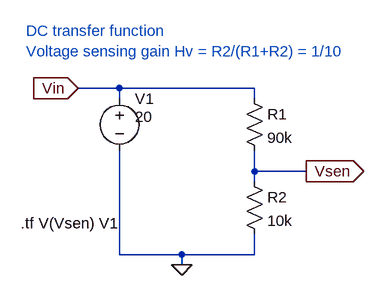
[diagram p0: schematic LTspice 03-4 tf1 voltage divider.asc]
LTspice 03-4 tf1 voltage divider.asc, the LTspice schematic file:
Version 4
SHEET 1 916 680
WIRE 400 192 336 192
WIRE 608 192 400 192
WIRE 400 208 400 192
WIRE 608 208 608 192
WIRE 608 320 608 288
WIRE 688 320 608 320
WIRE 608 336 608 320
WIRE 400 448 400 288
WIRE 496 448 400 448
WIRE 608 448 608 416
WIRE 608 448 496 448
WIRE 496 464 496 448
FLAG 496 464 0
FLAG 688 320 Vsen
IOPIN 688 320 Out
FLAG 336 192 Vin
IOPIN 336 192 In
SYMBOL voltage 400 192 R0
WINDOW 123 0 0 Left 2
WINDOW 39 0 0 Left 2
WINDOW 3 24 44 Left 2
SYMATTR Value 20
SYMATTR InstName V1
SYMBOL res 592 192 R0
SYMATTR InstName R1
SYMATTR Value 90k
SYMBOL res 592 320 R0
SYMATTR InstName R2
SYMATTR Value 10k
TEXT 248 400 Left 2 !.tf V(Vsen) V1
TEXT 256 104 Left 2 ;DC transfer function\nVoltage sensing gain Hv = R2/(R1+R2) = 1/10

The netlist it stands for:
* LTspice 03-4 tf1 voltage divider.asc
V1 Vin 0 20
R1 Vin Vsen 90k
R2 Vsen 0 10k
.tf V(Vsen) V1
* DC transfer function
* Voltage sensing gain Hv = R2/(R1+R2) = 1/10
.backanno
.end